# EAGLE schematic linear_voltage_regulator (EAGLE 6.4)
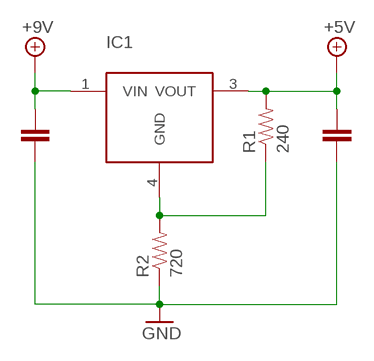
[diagram p0: schematic, sheet 1]

## Parts
C1  0.1uF  CAP0402-CAP  [0402-CAP]
C2  1uF  CAP0402-CAP  [0402-CAP]
IC1  LM2931_FIXED  [DPAK]
R1  240  RESISTOR0402-RES  [0402-RES]
R2  720  RESISTOR0402-RES  [0402-RES]

## Nets
+5V: C2.1 IC1.3(VOUT) R1.2
+9V: C1.1 IC1.1(VIN)
GND: C1.2 C2.2 R2.1
N$1: IC1.4(GND) R1.1 R2.2

## Library data of the parts
C1 C2 = SparkFun-Passives:CAP: Capacitor Standard 0603 ceramic capacitor, and 0.1" leaded capacitor.
IC1 = SparkFun-PowerIC:LM2931_FIXED: LDO regulator with reverse battery protection- very durable!
R1 R2 = SparkFun-Passives:RESISTOR: Resistor Basic schematic elements and footprints for 0603, 1206, and PTH resistors.